# Altium project DOCUMENTS.PRJPCB
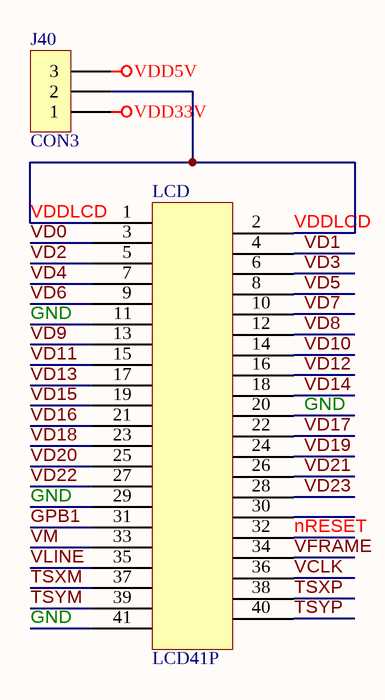
[diagram p0: 05I2S.SchDoc]
1 sheet, 2 parts. Net scope: global (net labels, ports and power ports of the same name join across sheets).

## Sheet 05I2S.SchDoc
size A4

### Parts
J40  CON3  [HDR1X3]
LCD  LCD41P  [FPC40]

### Nets
VDD5V: J40.3
VDD33V: J40.1
GND: LCD.11 LCD.20 LCD.29 LCD.41
GPB1: LCD.31
nRESET: LCD.32
TSXM: LCD.37
TSXP: LCD.38
TSYM: LCD.39
TSYP: LCD.40
VCLK: LCD.36
VD0: LCD.3
VD1: LCD.4
VD2: LCD.5
VD3: LCD.6
VD4: LCD.7
VD5: LCD.8
VD6: LCD.9
VD7: LCD.10
VD8: LCD.12
VD9: LCD.13
VD10: LCD.14
VD11: LCD.15
VD12: LCD.16
VD13: LCD.17
VD14: LCD.18
VD15: LCD.19
VD16: LCD.21
VD17: LCD.22
VD18: LCD.23
VD19: LCD.24
VD20: LCD.25
VD21: LCD.26
VD22: LCD.27
VD23: LCD.28
VDDLCD: J40.2 LCD.1 LCD.2
VFRAME: LCD.34
VLINE: LCD.35
VM: LCD.33

Not connected (* = marked no-connect by the designer): LCD 30

### Library data of the parts
J40 = CON3: Connector